# Altium project Mini.PrjPCB
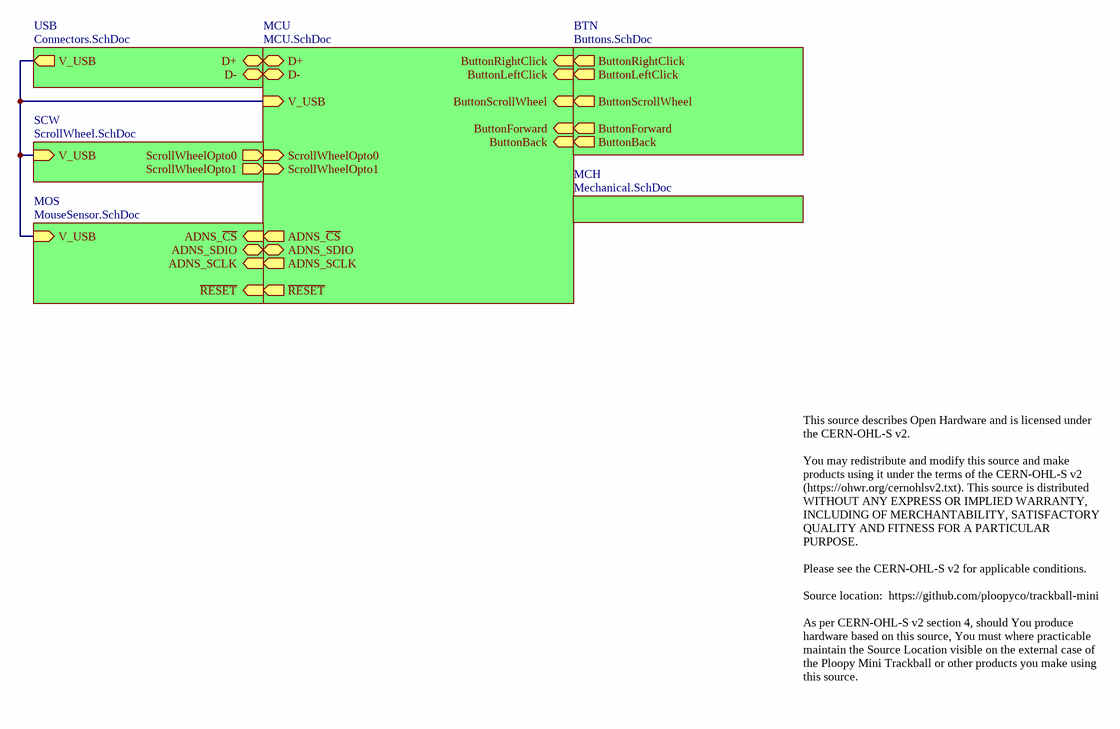
[diagram p0: Mini.SchDoc]
7 sheets, 73 parts. Net scope: hierarchical (ports join the sheet entries above them; power ports are global).
Board file: Mini.PcbDoc
Sheets:
  Mini.SchDoc
    USB = Connectors.SchDoc
    MCU = MCU.SchDoc
    BTN = Buttons.SchDoc
    MCH = Mechanical.SchDoc
    SCW = ScrollWheel.SchDoc
    MOS = MouseSensor.SchDoc

## Sheet Mini.SchDoc
size Letter; CompanyName: Ploopy Corporation; Organization: Ploopy Corporation; Address1: 137-1140 Burnhamthorpe Road W; Address2: Mississauga; Address3: Ontario; Address4: Canada L5C 0A3; DocumentNumber: 1; Revision: R1.002; SheetNumber: 1; SheetTotal: 8

### Sub-sheets
BTN = Buttons.SchDoc: ButtonRightClick (out), ButtonLeftClick (out), ButtonScrollWheel (out), ButtonForward (out), ButtonBack (out)
MCH = Mechanical.SchDoc: no entries
MCU = MCU.SchDoc: D+ (bidir), D- (bidir), ButtonRightClick (in), ButtonLeftClick (in), ButtonScrollWheel (in), V_USB (in), ButtonForward (in), ButtonBack (in), ScrollWheelOpto1 (in), ScrollWheelOpto0 (in), ~{RESET} (out), ADNS_SDIO (bidir), ADNS_~{CS} (out), ADNS_SCLK (out)
MOS = MouseSensor.SchDoc: ~{RESET} (in), V_USB (in), ADNS_~{CS} (in), ADNS_SDIO (bidir), ADNS_SCLK (in)
SCW = ScrollWheel.SchDoc: ScrollWheelOpto1 (out), ScrollWheelOpto0 (out), V_USB (in)
USB = Connectors.SchDoc: D+ (bidir), V_USB (out), D- (bidir)

### Nets
~{RESET}: sheet MCU/~{RESET}, sheet MOS/~{RESET}
V_USB: sheet USB/V_USB, sheet MCU/V_USB, sheet SCW/V_USB, sheet MOS/V_USB
NetQt1_E: sheet MCU/ScrollWheelOpto0, sheet SCW/ScrollWheelOpto0
NetQt2_E: sheet MCU/ScrollWheelOpto1, sheet SCW/ScrollWheelOpto1
NetR6_2: sheet USB/D-, sheet MCU/D-
NetR7_2: sheet USB/D+, sheet MCU/D+
NetSW1_A: sheet MCU/ButtonLeftClick, sheet BTN/ButtonLeftClick
NetSW2_A: sheet MCU/ButtonRightClick, sheet BTN/ButtonRightClick
NetSW5_A: sheet MCU/ButtonForward, sheet BTN/ButtonForward
NetSW7_A: sheet MCU/ButtonBack, sheet BTN/ButtonBack
NetSW8_B: sheet MCU/ButtonScrollWheel, sheet BTN/ButtonScrollWheel
NetU1_12: sheet MCU/ADNS_SCLK, sheet MOS/ADNS_SCLK
NetU1_28: sheet MCU/ADNS_~{CS}, sheet MOS/ADNS_~{CS}
NetU1_31: sheet MCU/ADNS_SDIO, sheet MOS/ADNS_SDIO

### Notes on the sheet
- This source describes Open Hardware and is licensed under the CERN-OHL-S v2.
  You may redistribute and modify this source and make products using it under the terms of the CERN-OHL-S v2 (https://ohwr.org/cernohlsv2.txt). This source is distributed WITHOUT ANY EXPRESS OR IMPLIED WARRANTY, INCLUDING OF MERCHANTABILITY, SATISFACTORY QUALITY AND FITNESS FOR A PARTICULAR PURPOSE.
  Please see the CERN-OHL-S v2 for applicable conditions.
  Source location:  https://github.com/ploopyco/trackball-mini
  As per CERN-OHL-S v2 section 4, should You produce hardware based on this source, You must where practicable maintain the Source Location visible on the external case of the Ploopy Mini Trackball or other products you make using this source.
- Copyright Ploopy Corporation 2021
- Licensed under the CERN-OHL-S v2
- http://ohwr.org/cernohl
- Title:
- PCB:
- Version:
- Ploopy Corporation
- Mississauga ON L5C 0A3
- 137-1140 Burnhamthorpe Road W
- Date:
- Time:
- Sheet
- of
- Canada

## Sheet Connectors.SchDoc
size Letter; CompanyName: Ploopy Corporation; Organization: Ploopy Corporation; Address1: 137-1140 Burnhamthorpe Road W; Address2: Mississauga; Address3: Ontario; Address4: Canada L5C 0A3; DocumentNumber: 3; Revision: R1.002; SheetNumber: 3; SheetTotal: 8
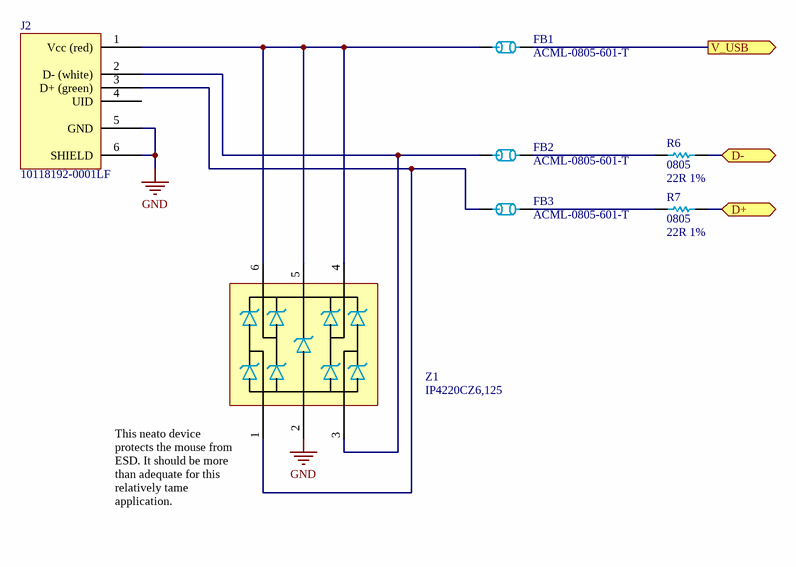
[diagram p1: Connectors.SchDoc]

### Parts
FB1  ACML-0805-601-T  [0805]
FB2  ACML-0805-601-T  [0805]
FB3  ACML-0805-601-T  [0805]
J2  10118192-0001LF  [10118192-0001LF]
R6  0805  value 22R 1%  [0805]
R7  0805  value 22R 1%  [0805]
Z1  IP4220CZ6,125  [PESD3V3S4UD - SOT95P275X110-6N]

### Ports
D+ (bidir), D- (bidir), V_USB (out)

### Nets
GND: J2.5(GND) J2.6(SHIELD) Z1.2
V_USB: FB1.2 ; port V_USB
NetFB1_1: FB1.1 J2.1(Vcc_(red)) Z1.4 Z1.5 Z1.6
NetFB2_1: FB2.1 J2.2(D-_(white)) Z1.3
NetFB2_2: FB2.2 R6.1
NetFB3_1: FB3.1 J2.3(D+_(green)) Z1.1
NetFB3_2: FB3.2 R7.1
NetR6_2: R6.2 ; port D-
NetR7_2: R7.2 ; port D+

Not connected (* = marked no-connect by the designer): J2 4(UID)

### Notes on the sheet
- (near Z1) This neato device protects the mouse from ESD. It should be more than adequate for this relatively tame application.
- Copyright Ploopy Corporation 2021
- Licensed under the CERN-OHL-S v2
- http://ohwr.org/cernohl
- Title:
- PCB:
- Version:
- Ploopy Corporation
- Mississauga ON L5C 0A3
- 137-1140 Burnhamthorpe Road W
- Date:
- Time:
- Sheet
- of
- Canada

### Library data of the parts
FB1-FB3 = ACML-0805-601-T: FERRITE BEAD 600 OHM 0805 1LN; Value: Ferrite Bead 600R; Supplier 1: Digi-Key; Supplier Part Number 1: 535-12556-1-ND
J2 = 10118192-0001LF: CONN RCPT USB2.0 MICRO B SMD R/A
R6 R7 = Res 22R 1% 0805: Chip resistor; Supplier 1: Digi-Key; Supplier 2: Arrow; Supplier Part Number 1: RMCF0805FT22R0CT-ND; Supplier Part Number 2: RMCF0805FT22R0
Z1 = IP4220CZ6,125: TVS DIODE 5.5V 6TSOP (Low capacitance, USB); Supplier 1: Digi-Key; Supplier 2: Mouser; Supplier 3: Arrow; Supplier Part Number 1: 1727-3578-1-ND; Supplier Part Number 2: 771-IP4220CZ6-T/R; Supplier Part Number 3: IP4220CZ6,125

## Sheet MCU.SchDoc
size Legal; CompanyName: Ploopy Corporation; Organization: Ploopy Corporation; Address1: 137-1140 Burnhamthorpe Road W; Address2: Mississauga; Address3: Ontario; Address4: Canada L5C 0A3; DocumentNumber: 4; Revision: R1.002; SheetNumber: 4; SheetTotal: 8
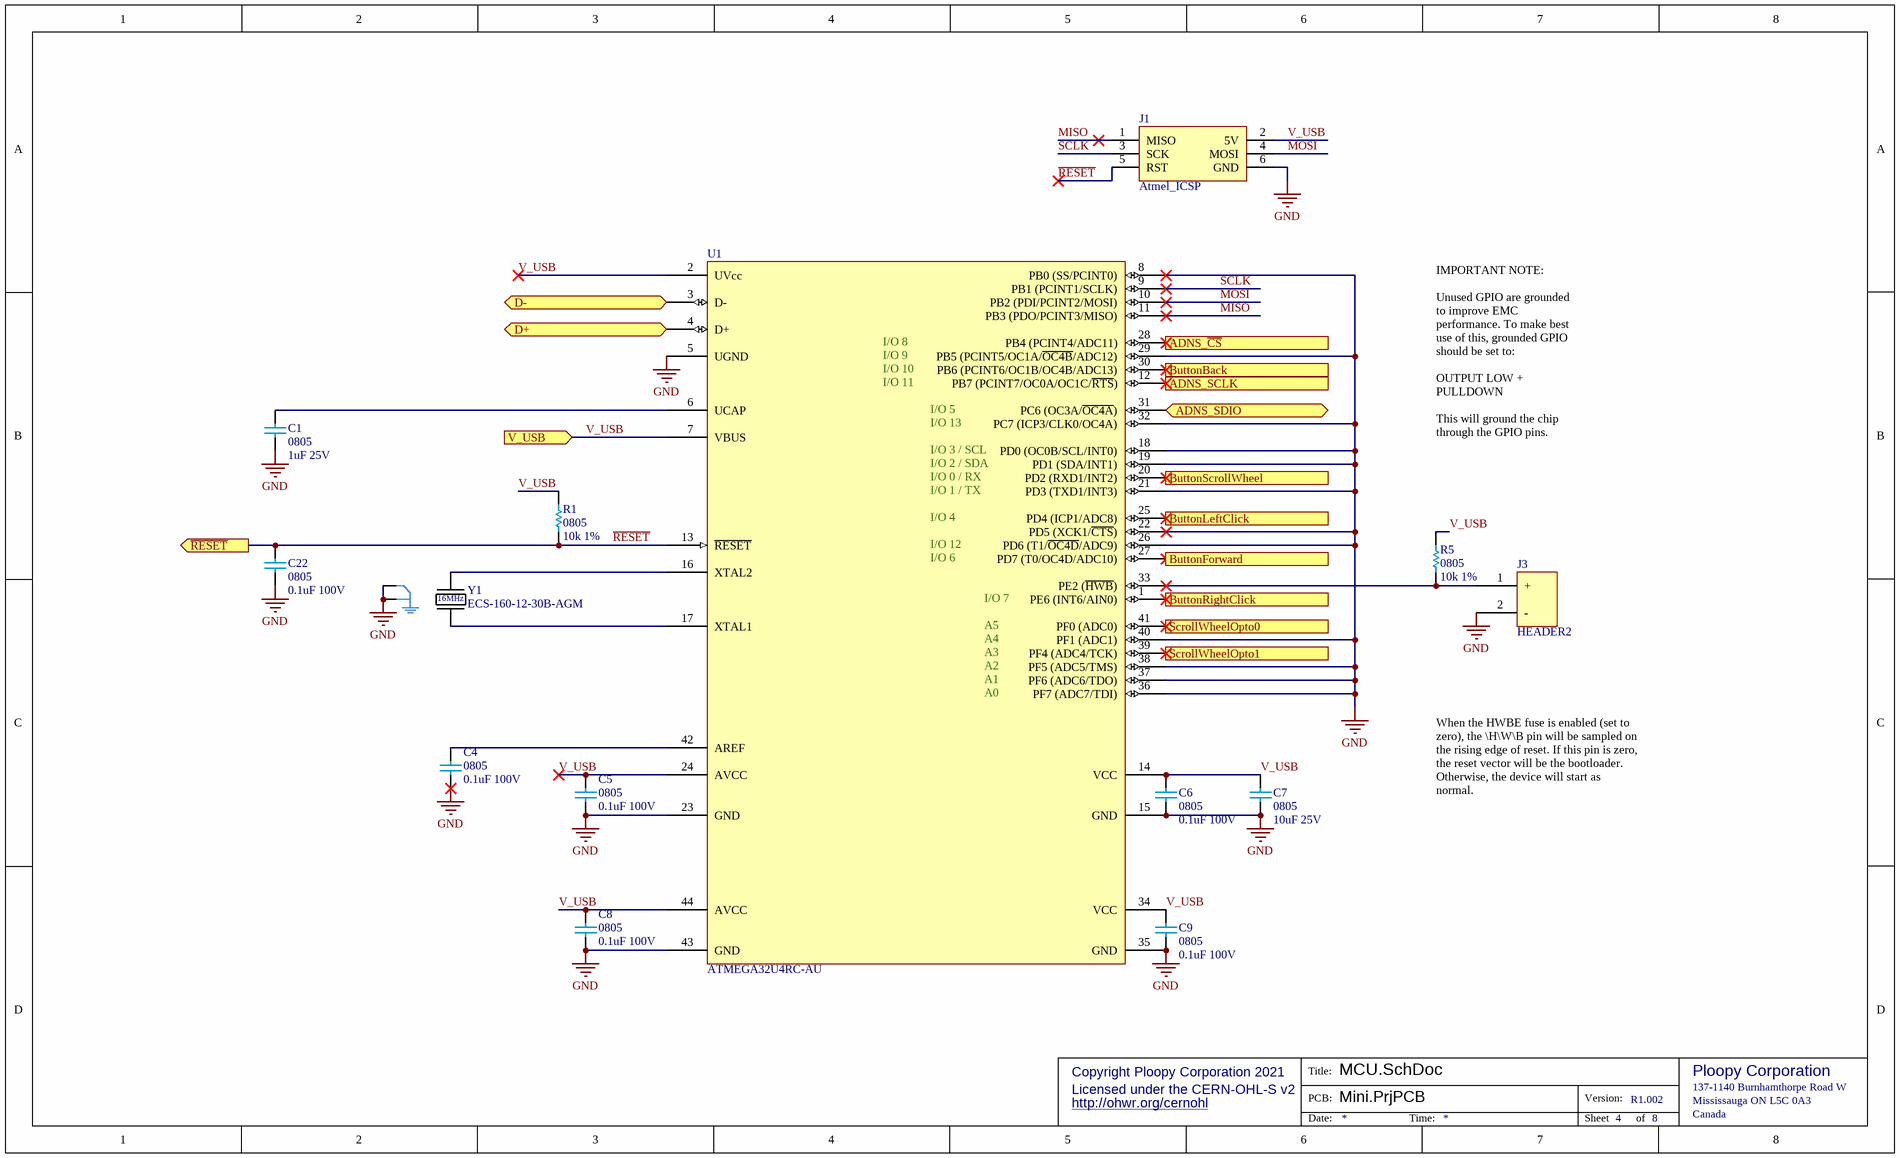
[diagram p2: MCU.SchDoc]

### Parts
(Parts that share a designator on the sheet are numbered #1, #2 ... from top to bottom, then left to right.)
C1  0805  value 1uF 25V  [0805 - TALL]
C4  0805  value 0.1uF 100V  [0805 - TALL]
C5  0805  value 0.1uF 100V  [0805 - TALL]
C6  0805  value 0.1uF 100V  [0805 - TALL]
C7  0805  value 10uF 25V  [0805 - TALL]
C8  0805  value 0.1uF 100V  [0805 - TALL]
C9  0805  value 0.1uF 100V  [0805 - TALL]
C22  0805  value 0.1uF 100V  [0805 - TALL]
J1  Atmel_ICSP  [6x2]
J3  HEADER2  [2x1]
R1#1  0805  value 10k 1%  [0805]
R5  0805  value 10k 1%  [0805]
U1  ATMEGA32U4RC-AU  [ATmega32U4 - TQFP80P1200X1200X120-44N]
Y1  ECS-160-12-30B-AGM  [LFXTAL055663BULK]

### Ports
ADNS_SCLK (out), ADNS_SDIO (bidir), ADNS_~{CS} (out), ButtonBack (in), ButtonForward (in), ButtonLeftClick (in), ButtonRightClick (in), ButtonScrollWheel (in), D+ (bidir), D- (bidir), ScrollWheelOpto0 (in), ScrollWheelOpto1 (in), V_USB (in), ~{RESET} (out)

### Nets
GND: C1.1 C4.1 C5.1 C6.1 C7.1 C8.1 C9.1 C22.1 J1.6(GND) J3.2(-) U1.5(UGND) U1.8(PB0_(SS/PCINT0)) U1.15(GND) U1.18(PD0_(OC0B/SCL/INT0)) U1.19(PD1_(SDA/INT1)) U1.21(PD3_(TXD1/INT3)) U1.22(PD5_(XCK1/~{CTS})) U1.23(GND) U1.26(PD6_(T1/~{OC4D}/ADC9)) U1.29(PB5_(PCINT5/OC1A/~{OC4B}/ADC12)) U1.32(PC7_(ICP3/CLK0/OC4A)) U1.35(GND) U1.36(PF7_(ADC7/TDI)) U1.37(PF6_(ADC6/TDO)) U1.38(PF5_(ADC5/TMS)) U1.40(PF1_(ADC1)) U1.43(GND) Y1.2 Y1.4
MISO: J1.1(MISO) U1.11(PB3_(PDO/PCINT3/MISO))
MOSI: J1.4(MOSI) U1.10(PB2_(PDI/PCINT2/MOSI))
~{RESET}: C22.2 J1.5(RST) R1#1.1 U1.13(~{RESET}) ; port ~{RESET}
SCLK: J1.3(SCK) U1.9(PB1_(PCINT1/SCLK))
V_USB: C5.2 C6.2 C7.2 C8.2 C9.2 J1.2(5V) R1#1.2 R5.2 U1.2(UVcc) U1.7(VBUS) U1.14(VCC) U1.24(AVCC) U1.34(VCC) U1.44(AVCC) ; port V_USB
NetC1_2: C1.2 U1.6(UCAP)
NetC4_2: C4.2 U1.42(AREF)
NetJ3_1: J3.1(+) R5.1 U1.33(PE2_(~{HWB}))
NetQt1_E: U1.41(PF0_(ADC0)) ; port ScrollWheelOpto0
NetQt2_E: U1.39(PF4_(ADC4/TCK)) ; port ScrollWheelOpto1
NetR6_2: U1.3(D-) ; port D-
NetR7_2: U1.4(D+) ; port D+
NetSW1_A: U1.25(PD4_(ICP1/ADC8)) ; port ButtonLeftClick
NetSW2_A: U1.1(PE6_(INT6/AIN0)) ; port ButtonRightClick
NetSW5_A: U1.27(PD7_(T0/OC4D/ADC10)) ; port ButtonForward
NetSW7_A: U1.30(PB6_(PCINT6/OC1B/OC4B/ADC13)) ; port ButtonBack
NetSW8_B: U1.20(PD2_(RXD1/INT2)) ; port ButtonScrollWheel
NetU1_12: U1.12(PB7_(PCINT7/OC0A/OC1C/~{RTS})) ; port ADNS_SCLK
NetU1_16: U1.16(XTAL2) Y1.1
NetU1_17: U1.17(XTAL1) Y1.3
NetU1_28: U1.28(PB4_(PCINT4/ADC11)) ; port ADNS_~{CS}
NetU1_31: U1.31(PC6_(OC3A/~{OC4A})) ; port ADNS_SDIO

### Notes on the sheet
- IMPORTANT NOTE:
  Unused GPIO are grounded to improve EMC performance. To make best use of this, grounded GPIO should be set to:
  OUTPUT LOW + PULLDOWN
  This will ground the chip through the GPIO pins.
- When the HWBE fuse is enabled (set to zero), the \H\W\B pin will be sampled on the rising edge of reset. If this pin is zero, the reset vector will be the bootloader. Otherwise, the device will start as normal.
- Copyright Ploopy Corporation 2021
- Licensed under the CERN-OHL-S v2
- http://ohwr.org/cernohl
- Title:
- PCB:
- Version:
- Ploopy Corporation
- Mississauga ON L5C 0A3
- 137-1140 Burnhamthorpe Road W
- Date:
- Time:
- Sheet
- of
- Canada
- (in symbol ATMEGA32U4RC-AU) I/O 8; I/O 9; I/O 10; I/O 11; I/O 5; I/O 13; I/O 3 / SCL; I/O 2 / SDA; I/O 0 / RX; I/O 1 / TX; I/O 4; I/O 12; I/O 6; I/O 7; A5; A4; A3; A2; A1; A0
- (in symbol ECS-160-12-30B-AGM) 16MHz

### Library data of the parts
C1 = Cap 1uF 25V: 0805, X5R or better; Supplier 1: Digi-Key; Supplier Part Number 1: 1276-1066-2-ND; Supplier 2: Digi-Key; Supplier Part Number 2: 1276-1066-1-ND
C4-C6 C8 C9 C22 = Cap 0.1uF 100V: 0805, X5R or better; Supplier 1: Digi-Key; Supplier Part Number 1: 1276-6840-2-ND
C7 = Cap 10uF 25V: 0805, X5R or better; Supplier 1: Mouser; Supplier Part Number 1: 81-GRM21BR61E106KA3L; Supplier 2: Digi-Key; Supplier Part Number 2: 490-5523-1-ND
J1 = Atmel_ICSP: 6-pin 0.100" ICSP header; Supplier 1: Digi-Key; Supplier Part Number 1: S2012EC-03-ND
J3 = HEADER2: 2-pin 0.100" header; Supplier 1: Mouser; Supplier Part Number 1: 855-M20-9990245; Supplier 2: Digi-Key; Supplier Part Number 2: 952-2261-ND
R1#1 R5 = Res 10k 1% 0805: Chip resistor; Supplier 1: Digi-Key; Supplier Part Number 1: RMCF0805FT10K0TR-ND
U1 = ATMEGA32U4RC-AU: IC MCU 8BIT 32KB FLASH 44TQFP; PNP-Nzl: 6; PNP-dx: 0; PNP-X: 12; PNP-A: 270; PNP-Pt: 1; PNP-W: 0.1; PNP-Thk: 1.6; PNP-Lv: 126; PNP-TS: 70; PNP-Level: 1.2; PNP-Type: QFP; PNP-FeedType: Tray; PNP-PlacePriority: 3; PNP-dy: 0; PNP-Y: 12; PNP-Voff: 0; PNP-da: 0; Supplier 1: Digi-Key; Supplier 2: Mouser; Supplier 3: Arrow; Supplier Part Number 1: ATMEGA32U4RC-AU-ND; Supplier Part Number 2: 556-ATMEGA32U4RC-AU; Supplier Part Number 3: ATMEGA32U4RC-AU
Y1 = ECS-160-12-30B-AGM: 16MHz Crystal 12pF 100 Ohms 4-SMD, No Lead; Supplier 1: Digi-Key; Supplier 2: Mouser; Supplier Part Number 1: XC2686CT-ND; Supplier Part Number 2: 520-160-12-30B-AGMT

## Sheet Buttons.SchDoc
size Letter; CompanyName: Ploopy Corporation; Organization: Ploopy Corporation; Address1: 137-1140 Burnhamthorpe Road W; Address2: Mississauga; Address3: Ontario; Address4: Canada L5C 0A3; DocumentNumber: 2; Revision: R1.002; SheetNumber: 2; SheetTotal: 8
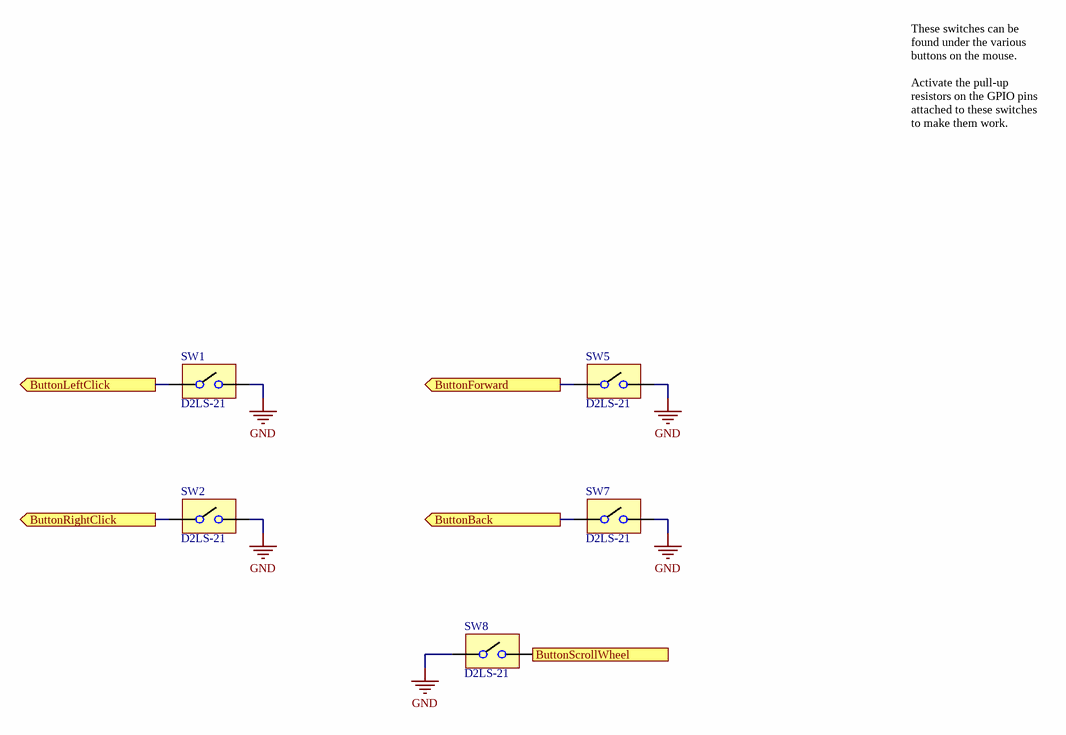
[diagram p3: Buttons.SchDoc]

### Parts
SW1  D2LS-21  [D2LS-21]
SW2  D2LS-21  [D2LS-21]
SW5  D2LS-21  [D2LS-21]
SW7  D2LS-21  [D2LS-21]
SW8  D2LS-21  [D2LS-21]

### Ports
ButtonBack (out), ButtonForward (out), ButtonLeftClick (out), ButtonRightClick (out), ButtonScrollWheel (out)

### Nets
GND: SW1.B SW2.B SW5.B SW7.B SW8.A
NetSW1_A: SW1.A ; port ButtonLeftClick
NetSW2_A: SW2.A ; port ButtonRightClick
NetSW5_A: SW5.A ; port ButtonForward
NetSW7_A: SW7.A ; port ButtonBack
NetSW8_B: SW8.B ; port ButtonScrollWheel

### Notes on the sheet
- These switches can be found under the various buttons on the mouse.
  Activate the pull-up resistors on the GPIO pins attached to these switches to make them work.
- Copyright Ploopy Corporation 2021
- Licensed under the CERN-OHL-S v2
- http://ohwr.org/cernohl
- Title:
- PCB:
- Version:
- Ploopy Corporation
- Mississauga ON L5C 0A3
- 137-1140 Burnhamthorpe Road W
- Date:
- Time:
- Sheet
- of
- Canada

### Library data of the parts
SW1 SW2 SW5 SW7 SW8 = D2LS-21: Compact Surface-mounting Switch for long durability; Supplier 1: Digi-Key; Supplier 2: Mouser; Supplier Part Number 1: Z4378CT-ND; Supplier Part Number 2: 653-D2LS-21

## Sheet Mechanical.SchDoc
size Letter; CompanyName: Ploopy Corporation; Organization: Ploopy Corporation; Address1: 137-1140 Burnhamthorpe Road W; Address2: Mississauga; Address3: Ontario; Address4: Canada L5C 0A3; DocumentNumber: 5; Revision: R1.002; SheetNumber: 5; SheetTotal: 8
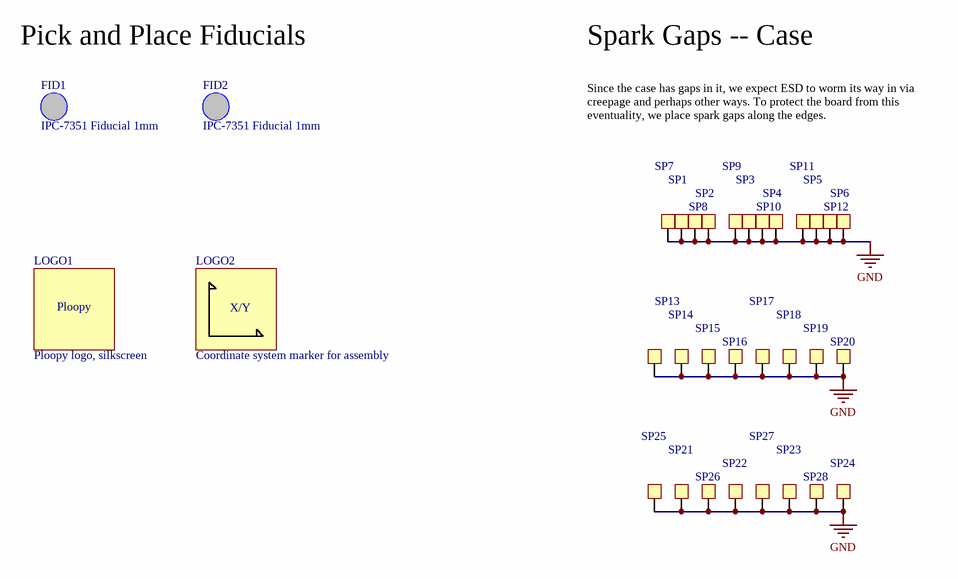
[diagram p4: Mechanical.SchDoc]

### Parts
FID1  IPC-7351 Fiducial 1mm  [FIDUCIAL_1.5]
FID2  IPC-7351 Fiducial 1mm  [FIDUCIAL_1.5]
LOGO1  Ploopy logo, silkscreen  [PloopyLogo]  (no BOM)
LOGO2  Coordinate system marker for assembly  [Coordinate System]  (no BOM)
SP1  Spark Gap  [SparkGap]  (value not drawn)  (no BOM)
SP2  Spark Gap  [SparkGap]  (value not drawn)  (no BOM)
SP3  Spark Gap  [SparkGap]  (value not drawn)  (no BOM)
SP4  Spark Gap  [SparkGap]  (value not drawn)  (no BOM)
SP5  Spark Gap  [SparkGap]  (value not drawn)  (no BOM)
SP6  Spark Gap  [SparkGap]  (value not drawn)  (no BOM)
SP7  Spark Gap  [SparkGap]  (value not drawn)  (no BOM)
SP8  Spark Gap  [SparkGap]  (value not drawn)  (no BOM)
SP9  Spark Gap  [SparkGap]  (value not drawn)  (no BOM)
SP10  Spark Gap  [SparkGap]  (value not drawn)  (no BOM)
SP11  Spark Gap  [SparkGap]  (value not drawn)  (no BOM)
SP12  Spark Gap  [SparkGap]  (value not drawn)  (no BOM)
SP13  Spark Gap  [SparkGap]  (value not drawn)  (no BOM)
SP14  Spark Gap  [SparkGap]  (value not drawn)  (no BOM)
SP15  Spark Gap  [SparkGap]  (value not drawn)  (no BOM)
SP16  Spark Gap  [SparkGap]  (value not drawn)  (no BOM)
SP17  Spark Gap  [SparkGap]  (value not drawn)  (no BOM)
SP18  Spark Gap  [SparkGap]  (value not drawn)  (no BOM)
SP19  Spark Gap  [SparkGap]  (value not drawn)  (no BOM)
SP20  Spark Gap  [SparkGap]  (value not drawn)  (no BOM)
SP21  Spark Gap  [SparkGap]  (value not drawn)  (no BOM)
SP22  Spark Gap  [SparkGap]  (value not drawn)  (no BOM)
SP23  Spark Gap  [SparkGap]  (value not drawn)  (no BOM)
SP24  Spark Gap  [SparkGap]  (value not drawn)  (no BOM)
SP25  Spark Gap  [SparkGap]  (value not drawn)  (no BOM)
SP26  Spark Gap  [SparkGap]  (value not drawn)  (no BOM)
SP27  Spark Gap  [SparkGap]  (value not drawn)  (no BOM)
SP28  Spark Gap  [SparkGap]  (value not drawn)  (no BOM)

### Nets
GND: SP1.1 SP2.1 SP3.1 SP4.1 SP5.1 SP6.1 SP7.1 SP8.1 SP9.1 SP10.1 SP11.1 SP12.1 SP13.1 SP14.1 SP15.1 SP16.1 SP17.1 SP18.1 SP19.1 SP20.1 SP21.1 SP22.1 SP23.1 SP24.1 SP25.1 SP26.1 SP27.1 SP28.1

Not connected (* = marked no-connect by the designer): FID1 1; FID2 1

### Notes on the sheet
- Pick and Place Fiducials
- Spark Gaps -- Case
- Since the case has gaps in it, we expect ESD to worm its way in via creepage and perhaps other ways. To protect the board from this eventuality, we place spark gaps along the edges.
- Copyright Ploopy Corporation 2021
- Licensed under the CERN-OHL-S v2
- http://ohwr.org/cernohl
- Title:
- PCB:
- Version:
- Ploopy Corporation
- Mississauga ON L5C 0A3
- 137-1140 Burnhamthorpe Road W
- Date:
- Time:
- Sheet
- of
- Canada
- (in symbol CoordinateSystem) X/Y
- (in symbol PloopyLogo) Ploopy

### Library data of the parts
FID1 FID2 = FIDUCIAL_1.5: PNP-Nzl: 2; PNP-dx: 0; PNP-X: 4; PNP-A: 1; PNP-Thk: 1.02; PNP-TS: 70; PNP-Type: MARK1; PNP-dy: 0; PNP-Y: 4; PNP-Pt: 0; PNP-W: 0; PNP-Lv: 1; PNP-Level: 1; PNP-Voff: 0; PNP-FeedType: Fiducial; PNP-TapeWidth: 0; PNP-PlacePriority: 0; PNP-TapeIndex: 0; PNP-da: 0
LOGO1 = PloopyLogo: PNP-Nzl: 2; PNP-dx: 0; PNP-X: 1; PNP-TS: 70; PNP-Type: CHI; PNP-FeedType: Tape; PNP-TapeWidth: 8; PNP-dy: 0; PNP-Y: 1; PNP-A: 0; PNP-Pt: 0; PNP-W: 0; PNP-Thk: 1; PNP-Lv: 1; PNP-Level: 1; PNP-Voff: 0; PNP-PlacePriority: 1; PNP-TapeIndex: 1; PNP-da: 0
LOGO2 = CoordinateSystem
SP1-SP28 = Spark Gap: Open square pad for spark gapping; PNP-Nzl: 2; PNP-dx: 0; PNP-X: 1; PNP-TS: 70; PNP-Type: CHI; PNP-FeedType: Tape; PNP-TapeWidth: 8; PNP-dy: 0; PNP-Y: 1; PNP-A: 0; PNP-Pt: 0; PNP-W: 0; PNP-Thk: 1; PNP-Lv: 1; PNP-Level: 1; PNP-Voff: 0; PNP-PlacePriority: 1; PNP-TapeIndex: 1; PNP-da: 0

## Sheet ScrollWheel.SchDoc
size Letter; CompanyName: Ploopy Corporation; Organization: Ploopy Corporation; Address1: 137-1140 Burnhamthorpe Road W; Address2: Mississauga; Address3: Ontario; Address4: Canada L5C 0A3; DocumentNumber: 8; Revision: R1.002; SheetNumber: 8; SheetTotal: 8
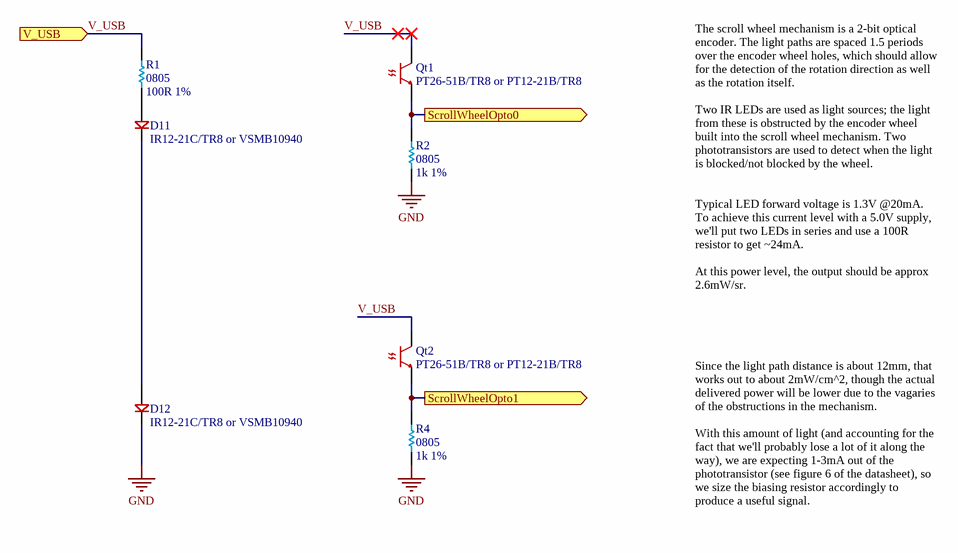
[diagram p5: ScrollWheel.SchDoc]

### Parts
(Parts that share a designator on the sheet are numbered #1, #2 ... from top to bottom, then left to right.)
D11  IR12-21C/TR8 or VSMB10940  [IR12-21C/TR8]
D12  IR12-21C/TR8 or VSMB10940  [IR12-21C/TR8]
Qt1  PT26-51B/TR8 or PT12-21B/TR8  [PT26-51B/TR8]
Qt2  PT26-51B/TR8 or PT12-21B/TR8  [PT26-51B/TR8]
R1#2  0805  value 100R 1%  [0805]
R2  0805  value 1k 1%  [0805]
R4#1  0805  value 1k 1%  [0805]

### Ports
ScrollWheelOpto0 (out), ScrollWheelOpto1 (out), V_USB (in)

### Nets
GND: D12.C R2.1 R4#1.1
V_USB: Qt1.C Qt2.C R1#2.2 ; port V_USB
NetD11_A: D11.A R1#2.1
NetD11_C: D11.C D12.A
NetQt1_E: Qt1.E R2.2 ; port ScrollWheelOpto0
NetQt2_E: Qt2.E R4#1.2 ; port ScrollWheelOpto1

### Notes on the sheet
- The scroll wheel mechanism is a 2-bit optical encoder. The light paths are spaced 1.5 periods over the encoder wheel holes, which should allow for the detection of the rotation direction as well as the rotation itself.
  Two IR LEDs are used as light sources; the light from these is obstructed by the encoder wheel built into the scroll wheel mechanism. Two phototransistors are used to detect when the light is blocked/not blocked by the wheel.
  Typical LED forward voltage is 1.3V @20mA. To achieve this current level with a 5.0V supply, we'll put two LEDs in series and use a 100R resistor to get ~24mA.
  At this power level, the output should be approx 2.6mW/sr.
  Since the light path distance is about 12mm, that works out to about 2mW/cm^2, though the actual delivered power will be lower due to the vagaries of the obstructions in the mechanism.
  With this amount of light (and accounting for the fact that we'll probably lose a lot of it along the way), we are expecting 1-3mA out of the phototransistor (see figure 6 of the datasheet), so we size the biasing resistor accordingly to produce a useful signal.
- Copyright Ploopy Corporation 2021
- Licensed under the CERN-OHL-S v2
- http://ohwr.org/cernohl
- Title:
- PCB:
- Version:
- Ploopy Corporation
- Mississauga ON L5C 0A3
- 137-1140 Burnhamthorpe Road W
- Date:
- Time:
- Sheet
- of
- Canada

### Library data of the parts
D11 D12 = IR12-21C/TR8: Infrared (IR) Emitter 880nm 1.3V 50mA 1mW/sr @ 20mA 30° 2-SMD, No Lead; Supplier 1: Digi-Key; Supplier 2: Mouser; Supplier 3: Digi-Key; Supplier 4: Mouser; Supplier 5: Arrow; Supplier Part Number 1: 1080-1351-1-ND; Supplier Part Number 2: 638-IR12-21C; Supplier Part Number 3: VSMB10940CT-ND; Supplier Part Number 4: 78-VSMB10940; Supplier Part Number 5: VSMB10940
Qt1 Qt2 = PT26-51B/TR8: Phototransistor 940nm Side View 1206 (3216 Metric); Supplier 1: Digi-Key; Supplier Part Number 1: 1080-1387-1-ND; Supplier 2: Digi-Key; Supplier Part Number 2: 1080-1377-1-ND
R1#2 = Res 100R 1% 0805: Chip resistor; Supplier 1: Digi-Key; Supplier 2: Digi-Key; Supplier Part Number 1: RMCF0805FT100RCT-ND; Supplier Part Number 2: RMCF0805FT100RTR-ND
R2 R4#1 = Res 1k 1% 0805: Chip resistor, 1/8W 100PPM; Supplier 1: Digi-Key; Supplier Part Number 1: RMCF0805FT1K00TR-ND

## Sheet MouseSensor.SchDoc
size Letter; CompanyName: Ploopy Corporation; Organization: Ploopy Corporation; Address1: 137-1140 Burnhamthorpe Road W; Address2: Mississauga; Address3: Ontario; Address4: Canada L5C 0A3; DocumentNumber: 6; Revision: R1.002; SheetNumber: 6; SheetTotal: 8
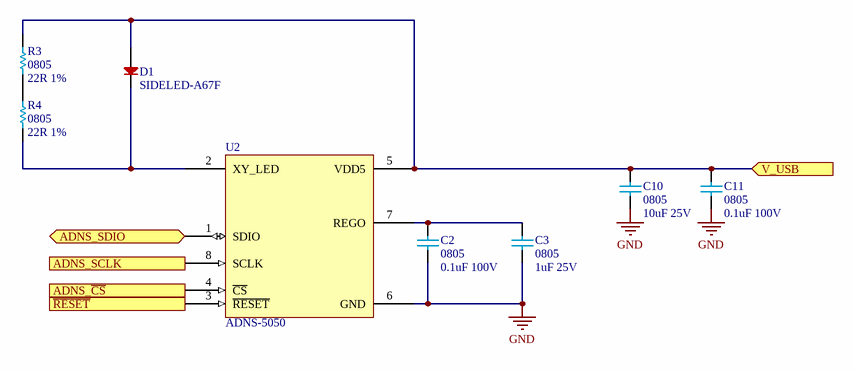
[diagram p6: MouseSensor.SchDoc]

### Parts
(Parts that share a designator on the sheet are numbered #1, #2 ... from top to bottom, then left to right.)
C2  0805  value 0.1uF 100V  [0805 - TALL]
C3  0805  value 1uF 25V  [0805 - TALL]
C10  0805  value 10uF 25V  [0805 - TALL]
C11  0805  value 0.1uF 100V  [0805 - TALL]
D1  SIDELED-A67F  [SIDELED-A67F]
R3  0805  value 22R 1%  [0805]
R4#2  0805  value 22R 1%  [0805]
U2  ADNS-5050  [ADNS-5050]

### Ports
ADNS_SCLK (in), ADNS_SDIO (bidir), ADNS_~{CS} (in), V_USB (in), ~{RESET} (in)

### Nets
GND: C2.1 C3.1 C10.1 C11.1 U2.6(GND)
~{RESET}: U2.3(~{RESET}) ; port ~{RESET}
V_USB: C10.2 C11.2 D1.A R3.2 U2.5(VDD5) ; port V_USB
NetC2_2: C2.2 C3.2 U2.7(REGO)
NetD1_C: D1.C R4#2.1 U2.2(XY_LED)
NetR3_1: R3.1 R4#2.2
NetU1_12: U2.8(SCLK) ; port ADNS_SCLK
NetU1_28: U2.4(~{CS}) ; port ADNS_~{CS}
NetU1_31: U2.1(SDIO) ; port ADNS_SDIO

### Notes on the sheet
- Copyright Ploopy Corporation 2021
- Licensed under the CERN-OHL-S v2
- http://ohwr.org/cernohl
- Title:
- PCB:
- Version:
- Ploopy Corporation
- Mississauga ON L5C 0A3
- 137-1140 Burnhamthorpe Road W
- Date:
- Time:
- Sheet
- of
- Canada

### Library data of the parts
C2 C11 = Cap 0.1uF 100V: 0805, X5R or better; Supplier 1: Digi-Key; Supplier Part Number 1: 1276-6840-2-ND
C3 = Cap 1uF 25V: 0805, X5R or better; Supplier 1: Digi-Key; Supplier Part Number 1: 1276-1066-2-ND; Supplier 2: Digi-Key; Supplier Part Number 2: 1276-1066-1-ND
C10 = Cap 10uF 25V: 0805, X5R or better; Supplier 1: Mouser; Supplier Part Number 1: 81-GRM21BR61E106KA3L; Supplier 2: Digi-Key; Supplier Part Number 2: 490-5523-1-ND
D1 = SIDELED-A67F: Red/Orange/Yellow Side-facing SMT LEDs, high brightness (~2lm); Supplier 2: Digi-Key; Supplier Part Number 2: 475-3415-6-ND; Supplier 1: Digi-Key; Supplier Part Number 1: 475-3392-1-ND
R3 R4#2 = Res 22R 1% 0805: Chip resistor; Supplier 1: Digi-Key; Supplier 2: Arrow; Supplier Part Number 1: RMCF0805FT22R0CT-ND; Supplier Part Number 2: RMCF0805FT22R0
U2 = ADNS-5050: Optical Mouse Navigation Sensor

## Nets that join several sheets
GND: Connectors (J2.5 J2.6 Z1.2), MCU (29 pins), Buttons (5 pins), Mechanical (28 pins), ScrollWheel (D12.C R2.1 R4#1.1), MouseSensor (5 pins)
NetQt1_E: MCU (U1.41), ScrollWheel (Qt1.E R2.2)
NetQt2_E: MCU (U1.39), ScrollWheel (Qt2.E R4#1.2)
NetR6_2: Connectors (R6.2), MCU (U1.3)
NetR7_2: Connectors (R7.2), MCU (U1.4)
NetSW1_A: MCU (U1.25), Buttons (SW1.A)
NetSW2_A: MCU (U1.1), Buttons (SW2.A)
NetSW5_A: MCU (U1.27), Buttons (SW5.A)
NetSW7_A: MCU (U1.30), Buttons (SW7.A)
NetSW8_B: MCU (U1.20), Buttons (SW8.B)
NetU1_12: MCU (U1.12), MouseSensor (U2.8)
NetU1_28: MCU (U1.28), MouseSensor (U2.4)
NetU1_31: MCU (U1.31), MouseSensor (U2.1)
~{RESET}: MCU (C22.2 J1.5 R1#1.1 U1.13), MouseSensor (U2.3)
V_USB: Connectors (FB1.2), MCU (14 pins), ScrollWheel (Qt1.C Qt2.C R1#2.2), MouseSensor (5 pins)

## Assembly variants
BoM: not fitted LED.C.21 LED.C.24 LED.C.26 LED.C.28 LED.D.2 LED.D.4 LED.D.6 LED.D.8 LED.R.17 LED.R.19 MCU.C.2 MCU.C.3 MCU.J.1 REG.C.13 REG.C.15 REG.C.17